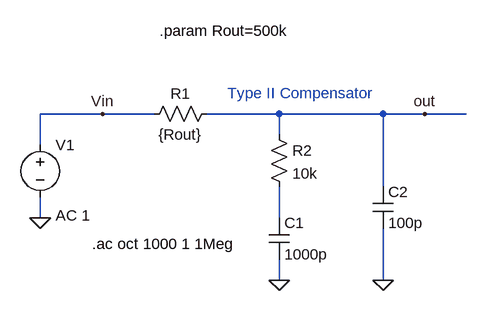
[diagram p0: schematic Type_II_Compensator_ckt.asc]
Type_II_Compensator_ckt.asc, the LTspice schematic file:
Version 4
SHEET 1 1312 680
WIRE 80 96 -16 96
WIRE 160 96 80 96
WIRE 352 96 240 96
WIRE 512 96 352 96
WIRE 576 96 512 96
WIRE 640 96 576 96
WIRE 352 128 352 96
WIRE -16 144 -16 96
WIRE 512 208 512 96
WIRE -16 256 -16 224
WIRE 352 256 352 208
WIRE 352 352 352 320
WIRE 512 352 512 272
FLAG -16 256 0
FLAG 352 352 0
FLAG 80 96 Vin
FLAG 576 96 out
FLAG 512 352 0
SYMBOL res 256 80 R90
WINDOW 0 0 56 VBottom 2
WINDOW 3 32 56 VTop 2
SYMATTR InstName R1
SYMATTR Value {Rout}
SYMBOL res 336 112 R0
SYMATTR InstName R2
SYMATTR Value 10k
SYMBOL cap 336 256 R0
SYMATTR InstName C1
SYMATTR Value 1000p
SYMBOL cap 496 208 R0
SYMATTR InstName C2
SYMATTR Value 100p
SYMBOL voltage -16 128 R0
WINDOW 123 24 124 Left 2
WINDOW 39 0 0 Left 0
SYMATTR InstName V1
SYMATTR Value ""
SYMATTR Value2 AC 1
TEXT 64 296 Left 2 !.ac oct 1000 1 1Meg
TEXT 272 64 Left 2 ;Type II Compensator
TEXT 168 -32 Left 2 !.param Rout=500k

The netlist it stands for:
* Type_II_Compensator_ckt.asc
R1 out Vin {Rout}
R2 out N001 10k
C1 N001 0 1000p
C2 out 0 100p
V1 Vin 0 AC 1
.ac oct 1000 1 1Meg
* Type II Compensator
.param Rout=500k
.backanno
.end